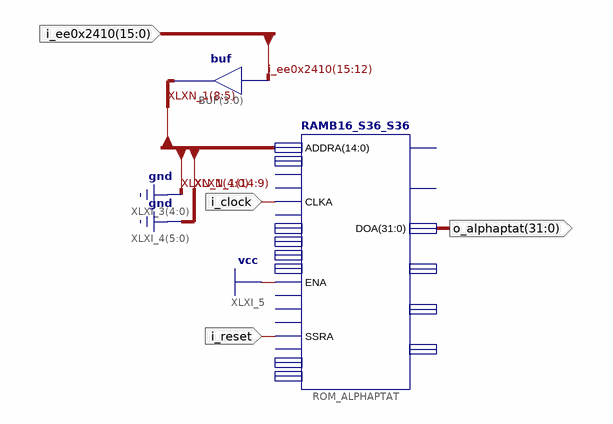
[diagram p0: schematic sheet 1]
// Xilinx ISE schematic ExtractAlphaPTATParameter.sch (spartan3e) as structural Verilog: 2 symbols, 4 ports
module ExtractAlphaPTATParameter (
  input  [15:0] i_ee0x2410,
  input  i_clock,
  input  i_reset,
  output [31:0] o_alphaptat
);

  wire [8:5] XLXN_1;

  RAMB16_S36_S36 #(.INIT_00("411c0000411800004114000041100000410c0000410800004104000041000000"), .INIT_01("413c0000413800004134000041300000412c0000412800004124000041200000"), .WRITE_WIDTH_B(36), .WRITE_WIDTH_A(36), .WRITE_MODE_B("READ_FIRST"), .WRITE_MODE_A("READ_FIRST"), .READ_WIDTH_B(36), .READ_WIDTH_A(36)) ROM_ALPHAPTAT (
    .ADDRA({{6{1'b0}}, XLXN_1, {5{1'b0}}}), .CLKA(i_clock), .ENA(1'b1), .SSRA(i_reset), .DOA(o_alphaptat));  // open: ADDRB, CASCADEINA, CASCADEINB, CLKB, DIA, DIB, DIPA, DIPB, REGCEA, REGCEB, ENB, SSRB, WEA, WEB, CASCADEOUTA, CASCADEOUTB, DOB, DOPA, DOPB
  assign XLXN_1 = i_ee0x2410[15:12];  // buf BUF[3..0], 4 bits wide
endmodule
